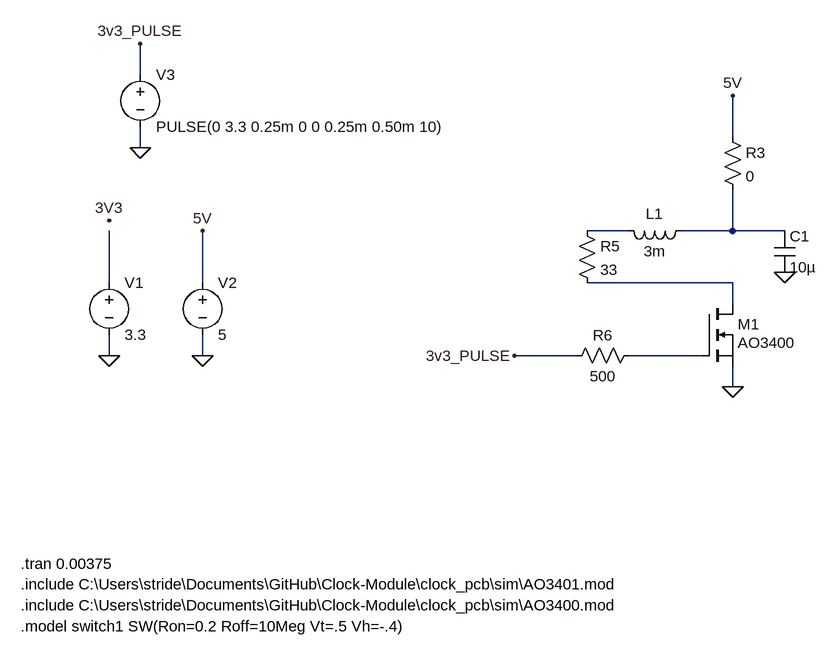
[diagram p0: schematic buzzer2.asc]
buzzer2.asc, the LTspice schematic file:
Version 4
SHEET 1 1272 688
WIRE -496 -176 -496 -224
WIRE 416 -80 416 -144
WIRE -496 -64 -496 -96
WIRE 256 64 192 64
WIRE 416 64 416 0
WIRE 416 64 336 64
WIRE 496 64 416 64
WIRE -544 144 -544 64
WIRE -400 144 -400 64
WIRE 416 144 192 144
WIRE 416 176 416 144
WIRE -544 256 -544 224
WIRE -400 256 -400 224
WIRE 176 256 80 256
WIRE 368 256 256 256
WIRE 416 304 416 272
FLAG -544 48 3V3
FLAG -400 256 0
FLAG -400 64 5V
FLAG -496 -224 3v3_PULSE
FLAG -496 -64 0
FLAG -544 256 0
FLAG 416 -144 5V
FLAG 416 304 0
FLAG 80 256 3v3_PULSE
FLAG 496 128 0
SYMBOL voltage -544 128 R0
WINDOW 123 0 0 Left 0
WINDOW 39 0 0 Left 0
SYMATTR InstName V1
SYMATTR Value 3.3
SYMBOL voltage -400 128 R0
WINDOW 123 0 0 Left 0
WINDOW 39 0 0 Left 0
SYMATTR InstName V2
SYMATTR Value 5
SYMBOL voltage -496 -192 R0
WINDOW 123 0 0 Left 0
WINDOW 39 0 0 Left 0
SYMATTR InstName V3
SYMATTR Value PULSE(0 3.3 0.25m 0 0 0.25m 0.50m 10)
SYMBOL nmos 368 176 R0
WINDOW 3 56 72 Invisible 2
WINDOW 38 56 60 Left 2
SYMATTR Value ""
SYMATTR SpiceModel AO3400
SYMATTR InstName M1
SYMATTR Prefix X
SYMBOL res 400 -96 R0
SYMATTR InstName R3
SYMATTR Value 0
SYMBOL res 176 48 R0
SYMATTR InstName R5
SYMATTR Value 33
SYMBOL res 272 240 R90
WINDOW 0 0 56 VBottom 2
WINDOW 3 32 56 VTop 2
SYMATTR InstName R6
SYMATTR Value 500
SYMBOL cap 480 64 R0
SYMATTR InstName C1
SYMATTR Value 10µ
SYMBOL ind 352 48 R90
WINDOW 0 5 56 VBottom 2
WINDOW 3 32 56 VTop 2
SYMATTR InstName L1
SYMATTR Value 3m
TEXT -680 608 Left 2 !.include C:\\Users\\stride\\Documents\\GitHub\\Clock-Module\\clock_pcb\\sim\\AO3401.mod
TEXT -680 576 Left 2 !.tran 0.00375
TEXT -680 640 Left 2 !.include C:\\Users\\stride\\Documents\\GitHub\\Clock-Module\\clock_pcb\\sim\\AO3400.mod
TEXT -680 672 Left 2 !.model switch1 SW(Ron=0.2 Roff=10Meg Vt=.5 Vh=-.4)

The netlist it stands for:
* buzzer2.asc
V1 N003 0 3.3
V2 5V 0 5
V3 3v3_PULSE 0 PULSE(0 3.3 0.25m 0 0 0.25m 0.50m 10)
XM1 N004 N005 0 AO3400  ; pins D G S
R3 5V N002 0
R5 N001 N004 33
R6 N005 3v3_PULSE 500
C1 N002 0 10µ
L1 N002 N001 3m
.include C:\Users\stride\Documents\GitHub\Clock-Module\clock_pcb\sim\AO3401.mod
.tran 0.00375
.include C:\Users\stride\Documents\GitHub\Clock-Module\clock_pcb\sim\AO3400.mod
.model switch1 SW(Ron=0.2 Roff=10Meg Vt=.5 Vh=-.4)
.backanno
.end